# EasyEDA Pro project ProPrj_飞行器设计之5.8Ghz图传_2025-12-20.epro, schematic 5.8Ghz图传_3
Create Date: 2022-09-13; Page Name: P1; Project Name: 飞行器设计之5.8Ghz图传; Schematic Name: 5.8Ghz图传_1; Update Date: 2022-10-12; Company: CYF
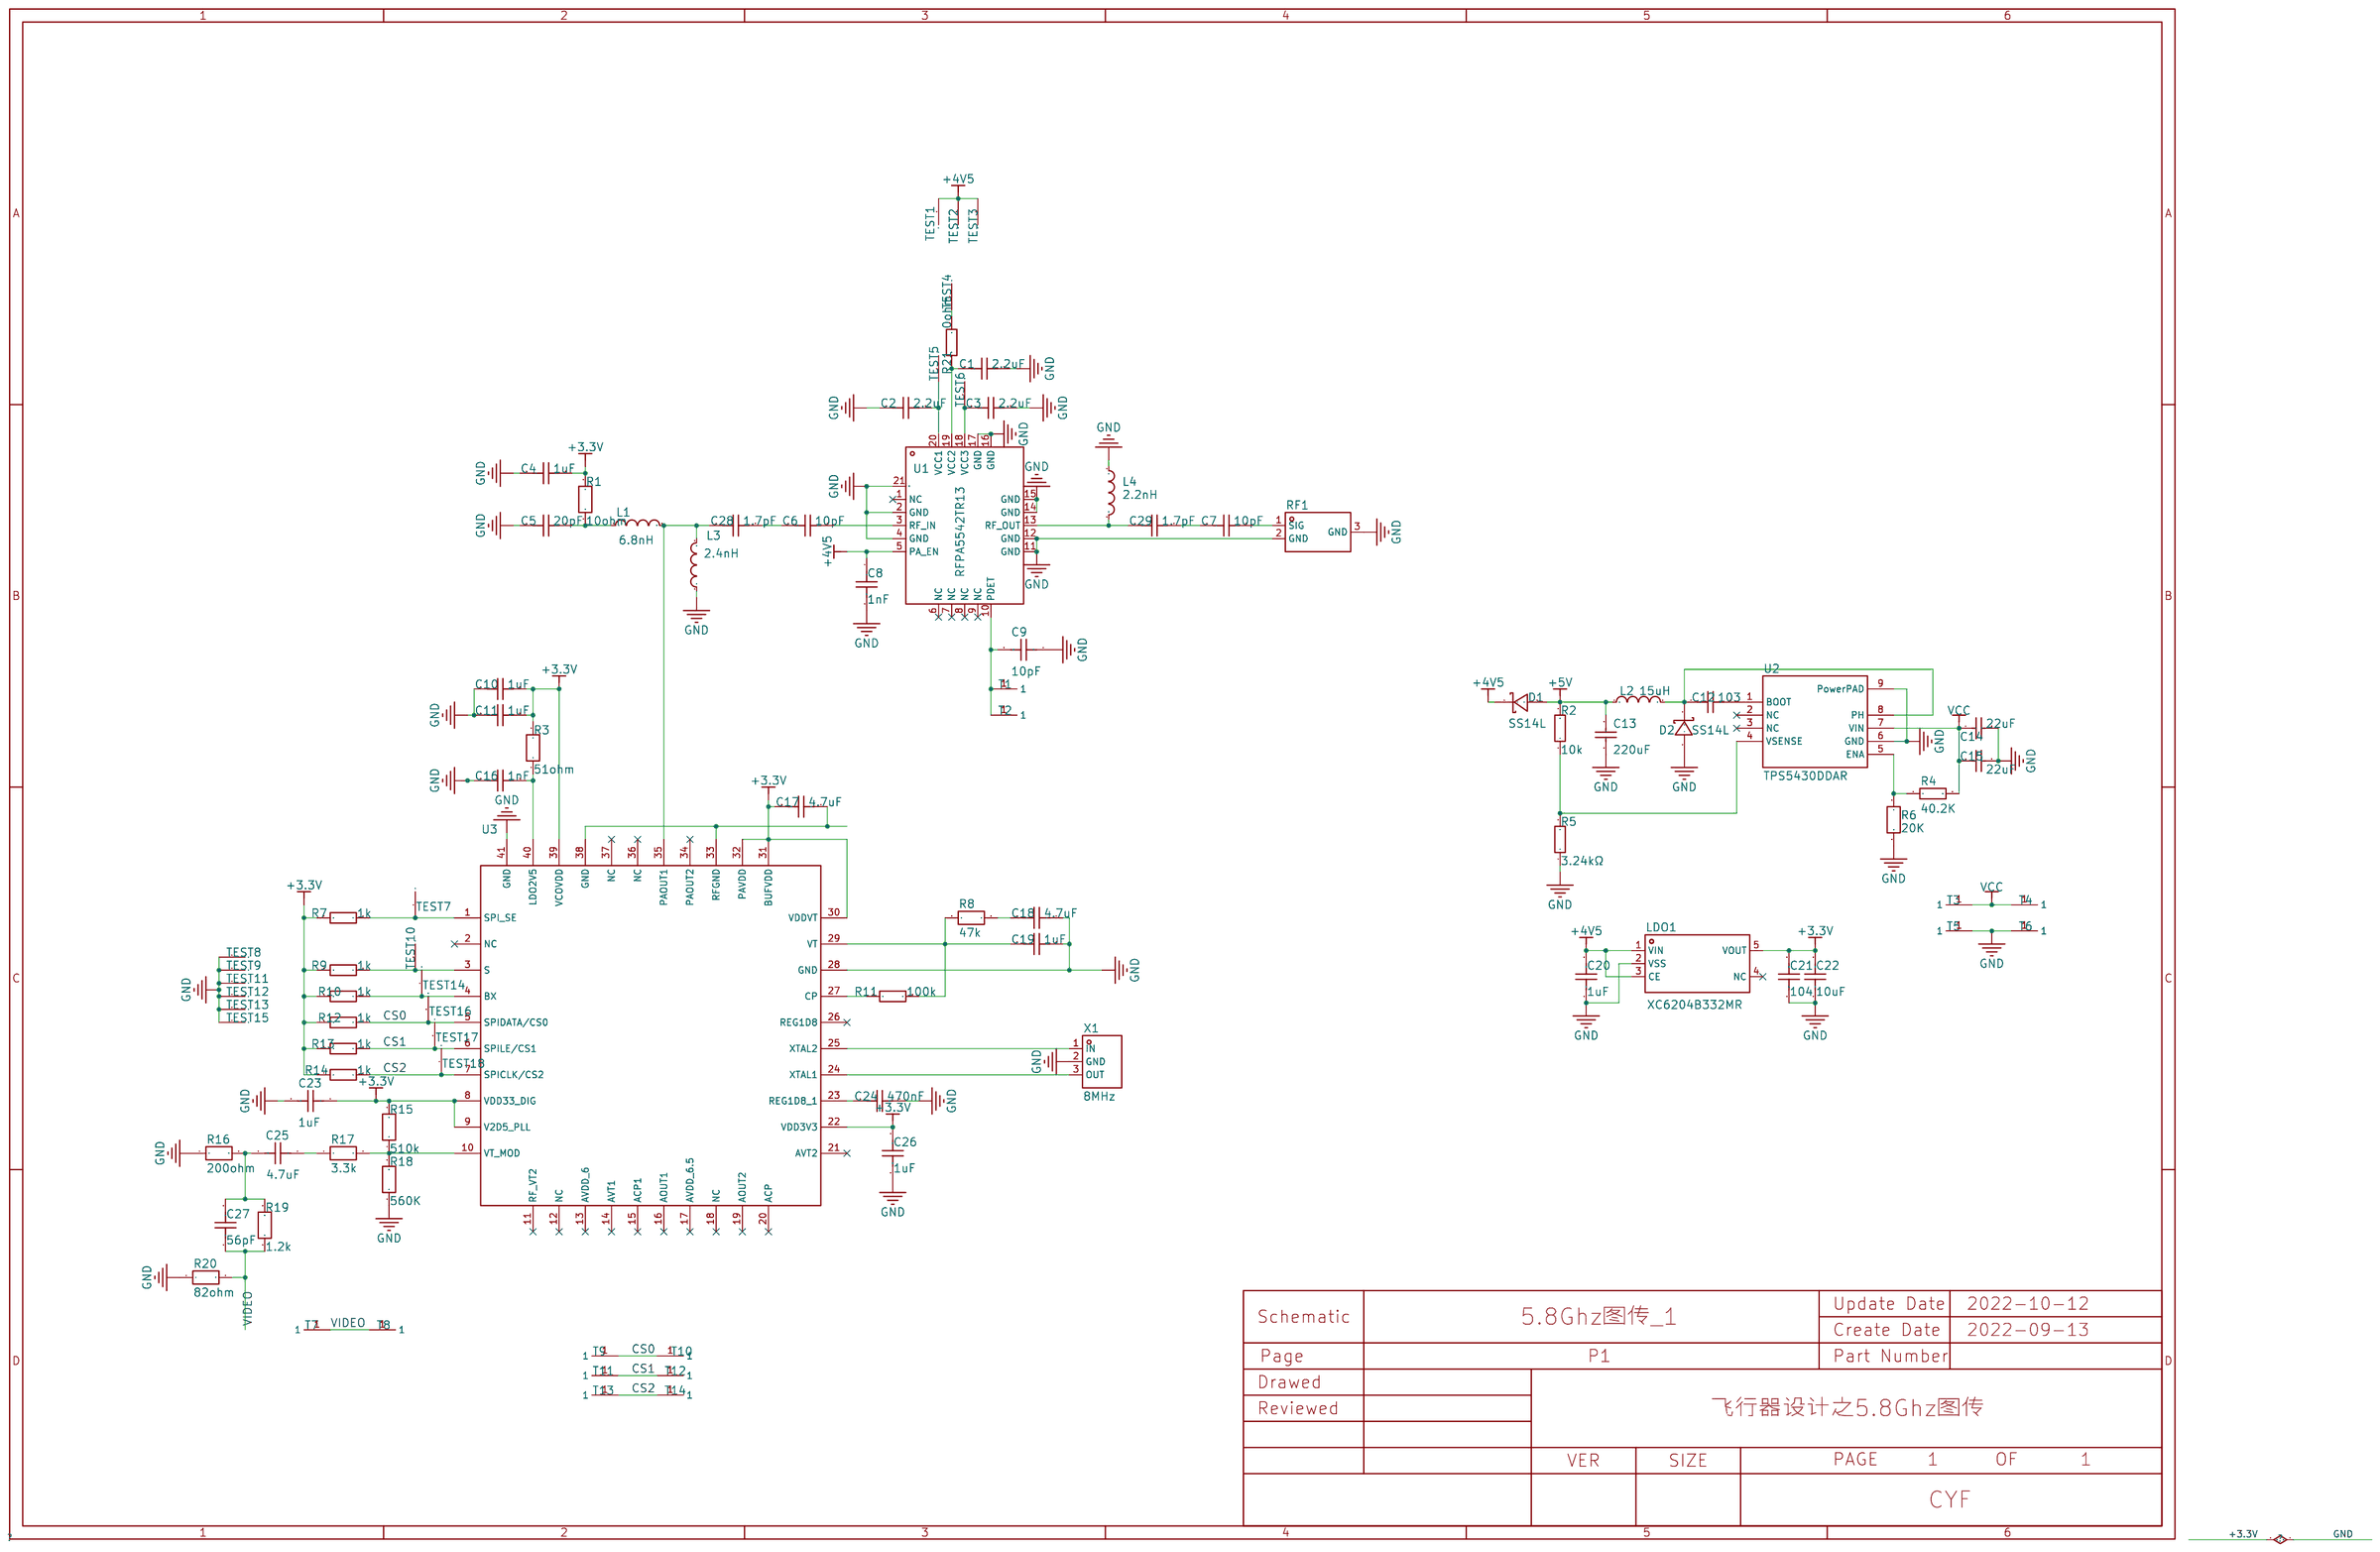
[diagram p2: schematic sheet]

## Parts
C1  2.2uF  [C0402]
C2  2.2uF  [C0402]
C3  2.2uF  [C0402]
C4  1uF  [C0402]
C5  20pF  [C0402-0.5]
C6  10pF  [C0201]
C7  10pF  [C0201]
C8  1nF  [C0402]
C9  10pF  [C0402]
C10  1uF  [C0402]
C11  1uF  [C0402]
C12  103  [C0402]
C13  220uF  [C1206]
C14  22uF  [C1206]
C15  22uF  [C1206]
C16  1nF  [C0402]
C17  4.7uF  [C0402]
C18  4.7uF  [C0402]
C19  1uF  [C0402]
C20  1uF  [C0402]
C21  104  [C0402]
C22  10uF  [C0402]
C23  1uF  [C0402]
C24  470nF  [C0402]
C25  4.7uF  [C0402]
C26  1uF  [C0402]
C27  56pF  [C0402]
C28  1.7pF  [C0201]
C29  1.7pF  [C0201]
D1  SS14L  [SOD-123F_L2.8-W1.8-LS3.7-RD]
D2  SS14L  [SOD-123F_L2.8-W1.8-LS3.7-RD]
L1  6.8nH  [L0402]
L2  15uH  [IND-SMD_L7.4-W6.6]
L3  2.4nH  [L0201]
L4  2.2nH  [L0201]
LDO1  XC6204B332MR  [SOT-23-5_L3.0-W1.7-P0.95-LS2.8-BR]
R1  10ohm  [R0402-0.5]
R2  10k  [R0402]
R3  51ohm  [R0402]
R4  40.2K  [R0402]
R5  3.24kΩ  [R0402]
R6  20K  [R0402]
R7  1k  [R0402]
R8  47k  [R0402]
R9  1k  [R0402]
R10  1k  [R0402]
R11  100k  [R0402]
R12  1k  [R0402]
R13  1k  [R0402]
R14  1k  [R0402]
R15  510k  [R0402]
R16  200ohm  [R0402]
R17  3.3k  [R0402]
R18  560K  [R0402]
R19  1.2k  [R0402]
R20  82ohm  [R0402]
R21  0ohm  [R0402]
RF1  BWIPX-1-001E  [IPEX-SMD_BWIPX-1-001E]
T1  -  [TEST_PAD]
T2  -  [TEST_PAD]
T3  -  [TEST_PAD]
T4  -  [TEST_PAD]
T5  -  [TEST_PAD]
T6  -  [TEST_PAD]
T7  -  [TEST_PAD]
T8  -  [TEST_PAD]
T9  -  [TEST_PAD]
T10  -  [TEST_PAD]
T11  -  [TEST_PAD]
T12  -  [TEST_PAD]
T13  -  [TEST_PAD]
T14  -  [TEST_PAD]
TEST1  -  [Test]
TEST2  -  [Test]
TEST3  -  [Test]
TEST4  -  [Test]
TEST5  -  [Test]
TEST6  -  [Test]
TEST7  -  [Test]
TEST8  -  [Test]
TEST9  -  [Test]
TEST10  -  [Test]
TEST11  -  [Test]
TEST12  -  [Test]
TEST13  -  [Test]
TEST14  -  [Test]
TEST15  -  [Test]
TEST16  -  [Test]
TEST17  -  [Test]
TEST18  -  [Test]
U1  RFPA5542TR13  [QFN-20_L4.0-W4.0]
U2  TPS5430DDAR  [SOIC-8_L5.0-W4.0-P1.27-LS6.0-BL-EP2.0]
U3  -  [QFN-40-1]
X1  8MHz  [OSC-SMD_3P-L3.2-W1.3-P1.2-L]

## Library data of the parts
C1-C3 = C1005X7S1A225KT000E: 温度系数:X7S;容值:2.2uF;电容体长:-;精度:±10%;电容体宽:-;电容体厚度:-;额定电压:10V;; LCSC Part Name: 2.2uF(225) ±10% 10V; Supplier Part: C445740; Manufacturer: TDK; Supplier Footprint: 0402; JLCPCB Part Class: Extended Part; Datasheet: https://atta.szlcsc.com/upload/public/pdf/source/20191108/C445740_EC5E1EA4727CB2A1B59729B04E8D3664.pdf; Supplier: LCSC; Temperature Coefficient: X7S; Tolerance: ±10%; Voltage Rated: 10V
C4 C10 C11 C19 C20 C23 C26 = C1005X5R1A105KTJ00F: 容值:1uF;精度:±10%;额定电压:10V;材质(温度系数):X5R;; LCSC Part Name: 1uF ±10% 10V; Supplier Part: C694162; Manufacturer: TDK; Supplier Footprint: 0402; JLCPCB Part Class: Extended Part; Datasheet: https://atta.szlcsc.com/upload/public/pdf/source/20191008/C432930_1569A900251E35B50161EFC1E9A1C511.pdf; Supplier: LCSC; Tolerance: ±10%; Voltage Rated: 10V; Temperature Coefficient: X5R
C5 = CC0201GRNPO9BN200: 温度系数:NP0;精度:±2%;电容体长:-;容值:20pF;电容体宽:-;电容体厚度:-;额定电压:50V;; Supplier: LCSC; Supplier Part: C541253; Supplier Footprint: 0201; JLCPCB Part Class: Extended Part; LCSC Part Name: 20pF ±2% 50V; Tolerance: ±2%; Datasheet: https://atta.szlcsc.com/upload/public/pdf/source/20200615/C541253_9EA6E2C9F1C0B6F889020B56608FD726.pdf; Manufacturer: YAGEO(国巨); Temperature Coefficient: NP0; Voltage Rated: 50V
C6 C7 C28 C29 = GJM0335C1E100FB01D: 容值:10pF;精度:±1%;额定电压:25V;材质(温度系数):C0G;; LCSC Part Name: 10pF ±1% 25V; Supplier Part: C2891570; Manufacturer: muRata(村田); Supplier Footprint: 0201; JLCPCB Part Class: Extended Part; Datasheet: https://atta.szlcsc.com/upload/public/pdf/source/20210910/F9DCB1D557D9855623001B89175B6F09.pdf; Supplier: LCSC; Tolerance: ±1%; Voltage Rated: 25V; Temperature Coefficient: C0G
C8 C16 = C0402C102K5RACAUTO: 温度系数:X7R;容值:1nF;精度:±10%;额定电压:50V;; LCSC Part Name: 1nF(102) ±10% 50V; Supplier Part: C141053; Manufacturer: KEMET(基美); Supplier Footprint: 0402; JLCPCB Part Class: Extended Part; Datasheet: https://atta.szlcsc.com/upload/public/pdf/source/20180326/C141053_0F41C27EF3713F9AA904312754A59387.pdf; Supplier: LCSC; Temperature Coefficient: X7R; Tolerance: ±10%; Voltage Rated: 50V
C9 = GRM1555C1H100FA01D: 容值:10pF;精度:±1%;额定电压:50V;温度系数:C0G;; LCSC Part Name: 10pF ±1% 50V; Supplier Part: C161520; Manufacturer: muRata(村田); Supplier Footprint: 0402; JLCPCB Part Class: Extended Part; Datasheet: https://atta.szlcsc.com/upload/public/pdf/source/20180403/C161520_9A02104BF56AEB009FBC9B33A38C7A93.pdf; Supplier: LCSC; Tolerance: ±1%; Voltage Rated: 50V; Temperature Coefficient: C0G
C12 C21 = CAP_0402: 容值:100nF;精度:±10%;额定电压:16V;温度系数:X7R;; Supplier Part: C1525; Supplier Footprint: 0402
C13 = 1206F476M160NT: 温度系数:Y5V;容值:47uF;精度:±20%;额定电压:16V;; LCSC Part Name: 47uF(476) ±20% 16V; Supplier Part: C30300; Manufacturer: FH(风华); Supplier Footprint: 1206; JLCPCB Part Class: Extended Part; Datasheet: https://atta.szlcsc.com/upload/public/pdf/source/20170923/C30300_1506149434227988720.pdf; Supplier: LCSC; Temperature Coefficient: Y5V; Tolerance: ±20%; Voltage Rated: 16V
C14 C15 = CL31A226KAHNNNE: 温度系数:X5R;额定电压:25V;精度:±10%;容值:22uF;; LCSC Part Name: 22uF(226) ±10% 25V; Supplier Part: C12891; Manufacturer: SAMSUNG(三星); Supplier Footprint: 1206; JLCPCB Part Class: Basic Part; Datasheet: https://atta.szlcsc.com/upload/public/pdf/source/20160103/1457707667836.pdf; Supplier: LCSC; Temperature Coefficient: X5R; Voltage Rated: 25V; Tolerance: ±10%
C17 C18 C25 = C1005X5R1A475KTJ00E: 容值:4.7uF;精度:±10%;额定电压:10V;材质(温度系数):X5R;; LCSC Part Name: 4.7uF ±10% 10V; Supplier Part: C342983; Manufacturer: TDK; Supplier Footprint: 0402; JLCPCB Part Class: Extended Part; Datasheet: https://atta.szlcsc.com/upload/public/pdf/source/20190225/C342983_2978EAEA2EB9BD3D70BC8CD3A599A0C7.pdf; Supplier: LCSC; Tolerance: ±10%; Voltage Rated: 10V; Temperature Coefficient: X5R
C22 = GRM155R61A106ME44D: 容值:10uF;精度:±20%;额定电压:10V;材质(温度系数):X5R;; LCSC Part Name: 10uF ±20% 10V; Supplier Part: C77000; Manufacturer: muRata(村田); Supplier Footprint: 0402; JLCPCB Part Class: Extended Part; Datasheet: https://atta.szlcsc.com/upload/public/pdf/source/20180530/C77000_4866797CFE3A842CD03C597EBD6AE6CD.pdf; Supplier: LCSC; Tolerance: ±20%; Voltage Rated: 10V; Temperature Coefficient: X5R
C24 = GRM155C81C474KE01D: 容值:470nF;精度:±10%;额定电压:16V;材质(温度系数):X6S;; LCSC Part Name: 470nF ±10% 16V; Supplier Part: C162162; Manufacturer: muRata(村田); Supplier Footprint: 0402; JLCPCB Part Class: Extended Part; Datasheet: https://atta.szlcsc.com/upload/public/pdf/source/20191226/C162162_83BD8EAA09A667F500D501D4FA61E7F9.pdf; Supplier: LCSC; Tolerance: ±10%; Voltage Rated: 16V; Temperature Coefficient: X6S
C27 = CL05C560JB51PNC: 容值:56pF;精度:±5%;额定电压:50V;材质(温度系数):C0G;; LCSC Part Name: 56pF ±5% 50V; Supplier Part: C472455; Manufacturer: SAMSUNG(三星); Supplier Footprint: 0402; JLCPCB Part Class: Extended Part; Datasheet: https://atta.szlcsc.com/upload/public/pdf/source/20191223/C472455_77C29F1AA91604A0158436A00A53DD86.pdf; Supplier: LCSC; Tolerance: ±5%; Voltage Rated: 50V; Temperature Coefficient: C0G
D1 D2 = SS14L: Supplier Part: C190475; Manufacturer: Hottech(合科泰); Supplier Footprint: SOD-123F; JLCPCB Part Class: Extended Part; Datasheet: https://atta.szlcsc.com/upload/public/pdf/source/20180420/C190475_B414FF979281B09C05D3FAC1A9A40A2C.pdf; Supplier: LCSC
L1 = LQW15AN6N8G00D: 额定电流:700mA;直流电阻(DCR):90mΩ;电感值:6.8nH;精度:±2%;饱和电流(Isat):-;; LCSC Part Name: 6.8nH ±2% 700mA; Supplier Part: C82919; Manufacturer: muRata(村田); Supplier Footprint: 0402; JLCPCB Part Class: Extended Part; Datasheet: https://atta.szlcsc.com/upload/public/pdf/source/20170325/1490427880931.pdf; Supplier: LCSC; Rated Current: 700mA; DC Resistance (DCR): 90mΩ; Tolerance: ±2%; Q @ Freq: 25 250MHz; Frequency - Self Resonant: 6GHz
L2 = MS0630-150M: 电感值:15uH;精度:±20%;额定电流:3A;直流电阻(DCR):98mΩ;; LCSC Part Name: 15uH ±20% 3A 98mΩ; Supplier Part: C380182; Manufacturer: COILMX(迈翔科技); Supplier Footprint: SMD; JLCPCB Part Class: Extended Part; Datasheet: https://atta.szlcsc.com/upload/public/pdf/source/20190429/C380182_4D41CE4A6A3D95630D4B8EF6485E7293.pdf; Supplier: LCSC; Tolerance: ±20%; Rated Current: 3A; DC Resistance (DCR): 98mΩ
L3 L4 = LQP03TG2N4B02D: 电感值:2.4nH;精度:±0.1nH;额定电流:-;饱和电流(Isat):-;直流电阻(DCR):250mΩ;; Supplier: LCSC; Supplier Part: C86108; Supplier Footprint: 0201; JLCPCB Part Class: Extended Part; LCSC Part Name: 2.4nH ±0.1nH 250mΩ; Tolerance: ±0.1nH; Datasheet: https://atta.szlcsc.com/upload/public/pdf/source/20180327/C86108_8DA9857F9A5B84622E13C1B3301582AB.pdf; Manufacturer: muRata(村田); DC Resistance (DCR): 250mΩ; Frequency - Self Resonant: 13.7GHz; Q @ Freq: 13@500MHz
LDO1 = XC6204B332MR: 输出类型:固定;输出极性:正;输出通道数:1;最大输入电压:10V;输出电压:3.3V;压差:330mV@(100mA);输出电流:150mA;电源纹波抑制比(PRSS):70dB@(10kHz);; LCSC Part Name: Vin=10V Vout=3.3V 150mA 70dB@(10kHz); Supplier Part: C80697; Manufacturer: TOREX(特瑞仕); Supplier Footprint: SOT-23-5; JLCPCB Part Class: Extended Part; Datasheet: https://atta.szlcsc.com/upload/public/pdf/source/20160903/1472896601676.pdf; Supplier: LCSC; Output Type: 固定; Output Polarity: 正; Number of Outputs: 1; Maximum Input Voltage: 10V; Output Voltage: 3.3V; Dropout Voltage: 330mV@(100mA); Output Current: 150mA; Power Supply Rejection Ratio (PRSS): 70dB@(10kHz)
R1 = ERJ1GNF10R0C: 阻值:10Ω;精度:±1%;功率:50mW;; Power(Watts): 50mW; Supplier: LCSC; Supplier Part: C717005; Supplier Footprint: 0201; JLCPCB Part Class: Extended Part; LCSC Part Name: 10Ω ±1% 50mW; Tolerance: ±1%; Datasheet: https://atta.szlcsc.com/upload/public/pdf/source/20201126/C717005_1D9EDC7DAFC9209451DC5B78B9B54637.pdf; Manufacturer: PANASONIC(松下)
R2 = RT0402BRD0710KL: 电阻类型:薄膜电阻;阻值:10kΩ;精度:±0.1%;功率:62.5mW;温度系数:±25ppm/;最大工作电压:50V;工作温度范围:-55~+155;; LCSC Part Name: 10kΩ ±0.1%; Supplier Part: C190095; Manufacturer: YAGEO(国巨); Supplier Footprint: 0402; JLCPCB Part Class: Extended Part; Datasheet: https://atta.szlcsc.com/upload/public/pdf/source/20180403/C190095_25C21481C63A8C51E2D9AAACC203371A.pdf; Supplier: LCSC; Type: 薄膜电阻; Tolerance: ±0.1%; Power(Watts): 62.5mW; Temperature Coefficient: ±25ppm/; Overload Voltage (Max): 50V; Operating Temperature Range: -55~+155
R3 = ERJ2RKF51R0X: 阻值:51Ω;精度:±1%;功率:100mW;温度系数:±100ppm/;最大工作电压:100V;工作温度范围:-55~+155;; LCSC Part Name: 51Ω ±1% 100mW; Supplier Part: C413057; Manufacturer: PANASONIC(松下); Supplier Footprint: 0402; JLCPCB Part Class: Extended Part; Datasheet: https://atta.szlcsc.com/upload/public/pdf/source/20190820/C413057_3C5D27E6BC9C8BDD75D5FF1586C00B52.pdf; Supplier: LCSC; Tolerance: ±1%; Power(Watts): 100mW; Temperature Coefficient: ±100ppm/; Overload Voltage (Max): 100V; Operating Temperature Range: -55~+155
R4 = 40.2KΩ: Supplier: LCSC; Supplier Part: C269389; Supplier Footprint: 0402; JLCPCB Part Class: Extended Part; LCSC Part Name: 40.2KΩ ±1%; Datasheet: https://atta.szlcsc.com/upload/public/pdf/source/20190115/C269389_D55A67C216E66C2189FB60879D6865B5.pdf; Manufacturer: Tyohm(幸亚电阻)
R5 = RT0402BRD0710KL: 电阻类型:薄膜电阻;阻值:10kΩ;精度:±0.1%;功率:62.5mW;温度系数:±25ppm/;最大工作电压:50V;工作温度范围:-55~+155;; Supplier Part: C190095; Manufacturer: YAGEO(国巨); Supplier Footprint: 0402; JLCPCB Part Class: Extended Part; Datasheet: https://atta.szlcsc.com/upload/public/pdf/source/20180403/C190095_25C21481C63A8C51E2D9AAACC203371A.pdf; Supplier: LCSC; Type: 薄膜电阻; Tolerance: ±0.1%; Power(Watts): 62.5mW; Temperature Coefficient: ±25ppm/; Overload Voltage (Max): 50V; Operating Temperature Range: -55~+155
R6 = 20K: 功率:1/16W;精度:±0.1%;温度系数:±25ppm/;温度系数:±25ppm/;阻值:20kΩ;; Supplier: LCSC; Supplier Part: C705630; Supplier Footprint: 0402; JLCPCB Part Class: Extended Part; LCSC Part Name: 20KΩ(20K) ±0.1%; Datasheet: https://atta.szlcsc.com/upload/public/pdf/source/20200720/C705630_F5CFB4D98A44D6C8057FA709CC75CD60.pdf; Manufacturer: YAGEO(国巨)
R7 R9 R10 R12-R14 = ERJ2RKF1001X: 阻值:1kΩ;精度:±1%;功率:100mW;温度系数:±100ppm/;最大工作电压:-;工作温度范围:-55~+155;; LCSC Part Name: 1kΩ ±1% 100mW; Supplier Part: C242161; Manufacturer: PANASONIC(松下); Supplier Footprint: 0402; JLCPCB Part Class: Extended Part; Datasheet: https://atta.szlcsc.com/upload/public/pdf/source/20181106/C242161_4F5F550A2C91B7234698FE1AE4119762.pdf; Supplier: LCSC; Tolerance: ±1%; Power(Watts): 100mW; Temperature Coefficient: ±100ppm/; Operating Temperature Range: -55~+155
R8 = ERJ2RKF4702X: LCSC Part Name: 47KΩ(4702) ±1%; Supplier Part: C413103; Manufacturer: PANASONIC(松下); Supplier Footprint: 0402; JLCPCB Part Class: Extended Part; Datasheet: https://atta.szlcsc.com/upload/public/pdf/source/20190820/C413103_733665ABBD1E1D82C449C55FBA055B2C.pdf; Supplier: LCSC
R11 = ERJ2RKF1003X: 阻值:100kΩ;精度:±1%;功率:100mW;温度系数:±100ppm/;最大工作电压:-;工作温度范围:-55~+155;; LCSC Part Name: 100kΩ ±1% 100mW 停产; Supplier Part: C192169; Manufacturer: PANASONIC(松下); Supplier Footprint: 0402; JLCPCB Part Class: Extended Part; Datasheet: https://atta.szlcsc.com/upload/public/pdf/source/20180502/C192169_E542DDD390EC9A5A5C2F0F641FE5D413.pdf; Supplier: LCSC; Tolerance: ±1%; Power(Watts): 100mW; Temperature Coefficient: ±100ppm/; Operating Temperature Range: -55~+155
R15 = ERJ2RKF5103X: 阻值:510kΩ;精度:±1%;功率:100mW;温度系数:±100ppm/;最大工作电压:-;工作温度范围:-55~+125;; LCSC Part Name: 510kΩ ±1% 100mW; Supplier Part: C413120; Manufacturer: PANASONIC(松下); Supplier Footprint: 0402; JLCPCB Part Class: Extended Part; Datasheet: https://atta.szlcsc.com/upload/public/pdf/source/20190820/C413120_F6905343057AF4F4B1F95E8F28A368B4.pdf; Supplier: LCSC; Tolerance: ±1%; Power(Watts): 100mW; Temperature Coefficient: ±100ppm/; Operating Temperature Range: -55~+125
R16 = CRCW0402200RFKED: 电阻类型:厚膜电阻;阻值:200Ω;精度:±1%;功率:63mW;温度系数:±100ppm/K;最大工作电压:50V;工作温度范围:-55~+155;; LCSC Part Name: 200Ω ±1% 63mW; Supplier Part: C482094; Manufacturer: VISHAY(威世); Supplier Footprint: 0402; JLCPCB Part Class: Extended Part; Datasheet: https://atta.szlcsc.com/upload/public/pdf/source/20200618/C481956_E25174B008CE8C884BEDD7D4D15E674F.pdf; Supplier: LCSC; Type: 厚膜电阻; Tolerance: ±1%; Power(Watts): 63mW; Temperature Coefficient: ±100ppm/K; Overload Voltage (Max): 50V; Operating Temperature Range: -55~+155
R17 = CRCW04023K30FKED: 最大工作电压:75V;工作温度范围:-55~+155;电阻长:-;精度:±1 %;功率:63mW;电阻直径:-;电阻高:-;电阻宽:-;温度系数:±100ppm/K;阻值:3.3kΩ;电阻类型:-;; LCSC Part Name: 3.3kΩ ±1%; Supplier Part: C482167; Manufacturer: VISHAY(威世); Supplier Footprint: 0402; JLCPCB Part Class: Extended Part; Datasheet: https://atta.szlcsc.com/upload/public/pdf/source/20200618/C481956_E25174B008CE8C884BEDD7D4D15E674F.pdf; Supplier: LCSC; Overload Voltage (Max): 75V; Operating Temperature Range: -55~+155; Tolerance: ±1 %; Power(Watts): 63mW; Temperature Coefficient: ±100ppm/K
R18 = ERJ2RKF5603X: Supplier: LCSC; Supplier Part: C413121; Supplier Footprint: 0402; JLCPCB Part Class: Extended Part; LCSC Part Name: 560KΩ(5603) ±1%; Datasheet: https://atta.szlcsc.com/upload/public/pdf/source/20190820/C413121_708116196E1F90A27E9EFDB3423FC67B.pdf; Manufacturer: PANASONIC(松下)
R19 = CQ02WGF1201TCE: 阻值:1.2kΩ;精度:±1%;功率:62.5mW;温度系数:±100ppm/;; LCSC Part Name: 1.2kΩ ±1% 62.5mW; Supplier Part: C966872; Manufacturer: UNI-ROYAL(厚声); Supplier Footprint: 0402; JLCPCB Part Class: Extended Part; Datasheet: https://atta.szlcsc.com/upload/public/pdf/source/20191220/C473620_6C11B82F3C06B184C34B0BC4B16C3771.pdf; Supplier: LCSC; Tolerance: ±1%; Power(Watts): 62.5mW; Temperature Coefficient: ±100ppm/
R20 = ERJ2RKF82R0X: 阻值:82Ω;精度:±1%;功率:100mW;温度系数:±100ppm/;最大工作电压:-;工作温度范围:-55~+125;; LCSC Part Name: 82Ω ±1%; Supplier Part: C413062; Manufacturer: PANASONIC(松下); Supplier Footprint: 0402; JLCPCB Part Class: Extended Part; Datasheet: https://atta.szlcsc.com/upload/public/pdf/source/20190820/C413062_AFB0A641FB0D2B21716E04467C9EB1B9.pdf; Supplier: LCSC; Tolerance: ±1%; Power(Watts): 100mW; Temperature Coefficient: ±100ppm/; Operating Temperature Range: -55~+125
R21 = RC0402FR-070RL: 温度系数:-;功率:1/16W;精度:±1%;阻值:0Ω;最大工作电压:50V;工作温度范围:-55~+155;; LCSC Part Name: 0Ω ±1%; Supplier Part: C106231; Manufacturer: YAGEO(国巨); Supplier Footprint: 0402; JLCPCB Part Class: Extended Part; Datasheet: https://atta.szlcsc.com/upload/public/pdf/source/20170518/1495085712260.pdf; Supplier: LCSC; Power(Watts): 1/16W; Tolerance: ±1%; Overload Voltage (Max): 50V; Operating Temperature Range: -55~+155
RF1 = BWIPX-1-001E: 连接器类型:板端;射频系列:IPEX;接口类型:内针;端口数量:1;阻抗:-;频率-最大值:-;样式:-;接口直径:-;接口长度/高度:-;工作温度范围:-;; LCSC Part Name: BWIPX-1-001E IPEX内针 天线座 IPEX-1 IPEX1 1代; Supplier Part: C496552; Manufacturer: BAT WIRELESS(蝙蝠无线); Supplier Footprint: SMD; JLCPCB Part Class: Extended Part; Datasheet: https://atta.szlcsc.com/upload/public/pdf/source/20201223/C496552_05E5A9956EAE1A8819C5051D085B1DED.pdf; Supplier: LCSC; Connector Type: 板端; RF Series: IPEX; Interface Type: 内针; Number of Ports: 1
T1-T14 = TEST_PAD
TEST1-TEST18 = Tset
U1 = RFPA5542TR13: 频率范围:-;IP1dB:-;增益:-;噪声系数:-;; Supplier Part: C469030; Manufacturer: Qorvo; Supplier Footprint: QFN_4X4mm; JLCPCB Part Class: Extended Part; Datasheet: https://atta.szlcsc.com/upload/public/pdf/source/20191212/C469030_D6F7318F7C7F55904A4BD83092D9C25F.pdf; Supplier: LCSC
U2 = TPS5430DDAR: 功能类型:降压型;同步整流:-;输出通道数:-;拓扑结构:-;输入电压:-;输出电流(最大值):-;开关频率:-;; LCSC Part Name: 降压型; Supplier Part: C9864; Manufacturer: TI(德州仪器); Supplier Footprint: SO-8; JLCPCB Part Class: Basic Part; Datasheet: https://atta.szlcsc.com/upload/public/pdf/source/20161207/1481104217724.pdf; Supplier: LCSC; Function: 降压型
U3 = RTC
X1 = CSTNE8M00G520000R0: 频率:8MHz;频率容差:±0.5%;内藏负载电容:10pF;谐振阻抗:40Ω;; LCSC Part Name: 8.000MHz 10pF; Supplier Part: C907975; Manufacturer: muRata(村田); Supplier Footprint: SMD3213-3P; JLCPCB Part Class: Extended Part; Datasheet: https://atta.szlcsc.com/upload/public/pdf/source/20201022/C907975_BE77A173E35C03920A12013DDB2B8858.pdf; Supplier: LCSC; Frequency Stability: ±0.2%; Frequency Tolerance: ±0.5%; Built-in Load Capacitance: 10pF; Resonant Impedance: 40Ω; Operating Temperature: -40~+85

## Nets
+3.3V: C1.2 C2.1 C3.2 C4.1 C4.2 C5.1 C8.2 C9.1 C10.1 C10.2 C11.1 C11.2 C13.1 C14.2 C15.2 C16.2 C17.1 C17.2 C18.1 C19.1 C20.1 C21.1 C21.2 C22.1 C22.2 C23.1 C23.2 C24.2 C26.1 C26.2 D2.2(A) L3.1 L4.1 LDO1.2(VSS) LDO1.5(VOUT) R1.2 R3.2 R5.1 R6.2 R7.2 R9.2 R10.2 R12.2 R13.2 R14.2 R15.2 R16.1 R18.1 R20.1 RF1.2(GND) RF1.3(GND) T5.1 T6.1 TEST8.1 TEST9.1 TEST11.1 TEST12.1 TEST13.1 TEST15.1 U1.2(GND) U1.4(GND) U1.11(GND) U1.12(GND) U1.14(GND) U1.15(GND) U1.16(GND) U1.17(GND) U1.21(PAD) U2.6(GND) U2.9(PowerPAD) U3.8(VDD33_DIG) U3.9(V2D5_PLL) U3.22(VDD3V3) U3.28(GND) U3.30(VDDVT) U3.31(BUFVDD) U3.32(PAVDD) U3.33(RFGND) U3.38(GND) U3.39(VCOVDD) U3.41(GND) X1.2(GND)
+4V5: C8.1 C20.2 D1.1(K) LDO1.1(VIN) LDO1.3(CE) TEST1.1 TEST2.1 TEST3.1 U1.5(PA_EN)
+5V: C13.2 D1.2(A) L2.1 R2.2
VCC: C14.1 C15.1 R4.2 T3.1 T4.1 U2.7(VIN)
CS0: R12.1 T9.1 T10.1 TEST16.1 U3.5(SPIDATA/CS0)
CS1: R13.1 T11.1 T12.1 TEST17.1 U3.6(SPILE/CS1)
CS2: R14.1 T13.1 T14.1 TEST18.1 U3.7(SPICLK/CS2)
VIDEO: C27.1 R19.1 R20.2 T7.1 T8.1
$1N985: C12.2 U2.1(BOOT)
$1N1270: C12.1 D2.1(K) L2.2 U2.8(PH)
$1N2973: R4.1 R6.1 U2.5(ENA)
$1N29749: R9.1 TEST10.1 U3.3(S)
$1N29784: R10.1 TEST14.1 U3.4(BX)
$1N30691: R7.1 TEST7.1 U3.1(SPI_SE)
$1N35430: R15.1 R17.2 R18.2 U3.10(VT_MOD)
$1N35502: C25.1 R17.1
$1N37428: C25.2 C27.2 R16.2 R19.2
$1N43323: R11.1 U3.27(CP)
$1N43978: C18.2 R8.2
$1N44248: C19.2 R8.1 R11.2 U3.29(VT)
$1N44995: U3.25(XTAL2) X1.1(IN)
$1N45085: U3.24(XTAL1) X1.3(OUT)
$1N52247: C16.1 R3.1 U3.40(LDO2V5)
$1N57648: C5.2 L1.1 R1.1
$1N59286: C6.2 U1.3(RF_IN)
$1N64215: C24.1 U3.23(REG1D8_1)
$1N65846: C9.2 T1.1 T2.1 U1.10(PDET)
$1N103981: C7.2 RF1.1(SIG)
$1N115820: C2.2 TEST5.1 U1.20(VCC1)
$1N117066: C3.1 TEST6.1 U1.18(VCC3)
$1N131298: R2.1 R5.2 U2.4(VSENSE)
$1N139673: R21.2 TEST4.1
$1N140523: C1.1 R21.1 U1.19(VCC2)
$1N148789: C7.1 C29.2
$1N149074: C29.1 L4.2 U1.13(RF_OUT)
$1N149538: C6.1 C28.2
$1N149835: C28.1 L1.2 L3.2 U3.35(PAOUT1)

Not connected (* = marked no-connect by the designer): LDO1 4(NC)*; U1 1(NC)* 6(NC)* 7(NC)* 8(NC)* 9(NC)*; U2 2(NC)* 3(NC)*; U3 2(NC)* 11(RF_VT2)* 12(NC)* 13(AVDD_6)* 14(AVT1)* 15(ACP1)* 16(AOUT1)* 17(AVDD_6.5)* 18(NC)* 19(AOUT2)* 20(ACP)* 21(AVT2)* 26(REG1D8)* 34(PAOUT2)* 36(NC)* 37(NC)*
